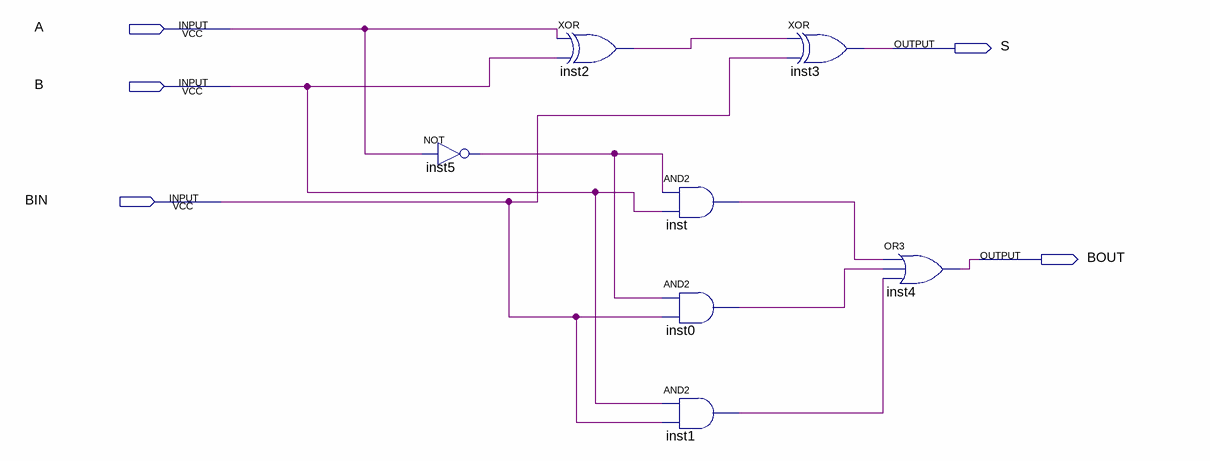
[diagram p0: schematic sheet]
// Quartus schematic subtrator1bit.bdf as structural Verilog: 7 symbols, 5 pins
module subtrator1bit (
  input  A,
  input  B,
  input  BIN,
  output S,
  output BOUT
);

  wire inst0_out, inst1_out, inst2_out, inst5_out, inst_out;

  not inst5 (inst5_out, A);
  xor inst2 (inst2_out, A, B);
  and inst (inst_out, inst5_out, B);
  and inst0 (inst0_out, inst5_out, BIN);
  and inst1 (inst1_out, B, BIN);
  xor inst3 (S, inst2_out, BIN);
  or inst4 (BOUT, inst_out, inst0_out, inst1_out);
endmodule
